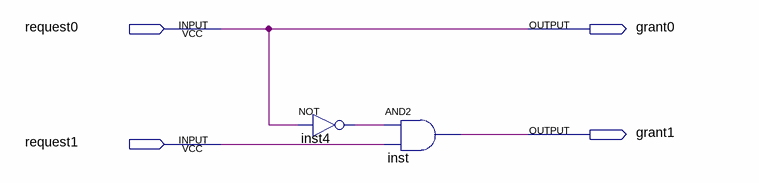
[diagram p0: schematic sheet]
// Quartus schematic Arbitrator.bdf as structural Verilog: 2 symbols, 4 pins
module Arbitrator (
  input  request0,
  input  request1,
  output grant0,
  output grant1
);

  wire inst4_out;

  not inst4 (inst4_out, request0);
  and inst (grant1, inst4_out, request1);

  assign grant0 = request0;
endmodule
